# Altium schematic sheet Power.SchDoc
size A; SheetNumber: 1; SheetTotal: 1
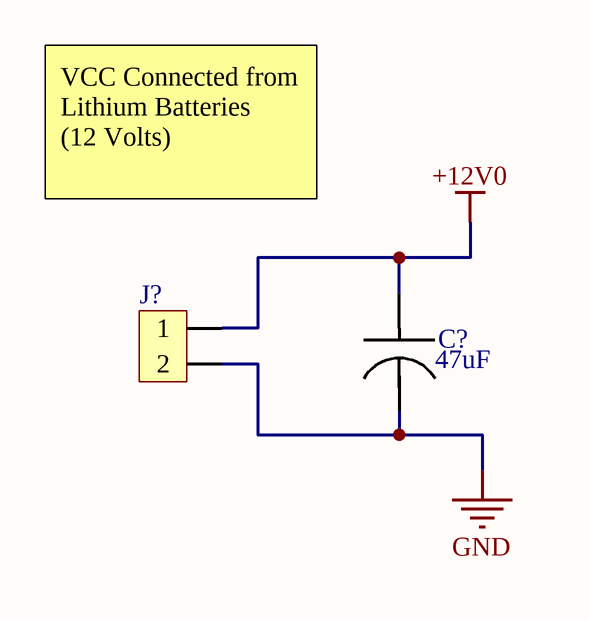
[diagram p0: Power.SchDoc]

## Parts
C?  value 47uF  [ALCap.]  (hidden comment: ALCapacitor)
J?  Terminal Block 2-pins  [Terminal Block 2 Plugable]  (value not drawn)

## Nets
+12V0: C?.1 J?.1
GND: C?.2 J?.2

## Notes on the sheet
- VCC Connected from Lithium Batteries
  (12 Volts)

## Library data of the parts
J? = Terminal Block 2-pins: PN: 1935161; MF: Phoenix Contact; Supplier: Digikey; Supplier PN: 277-1667-ND